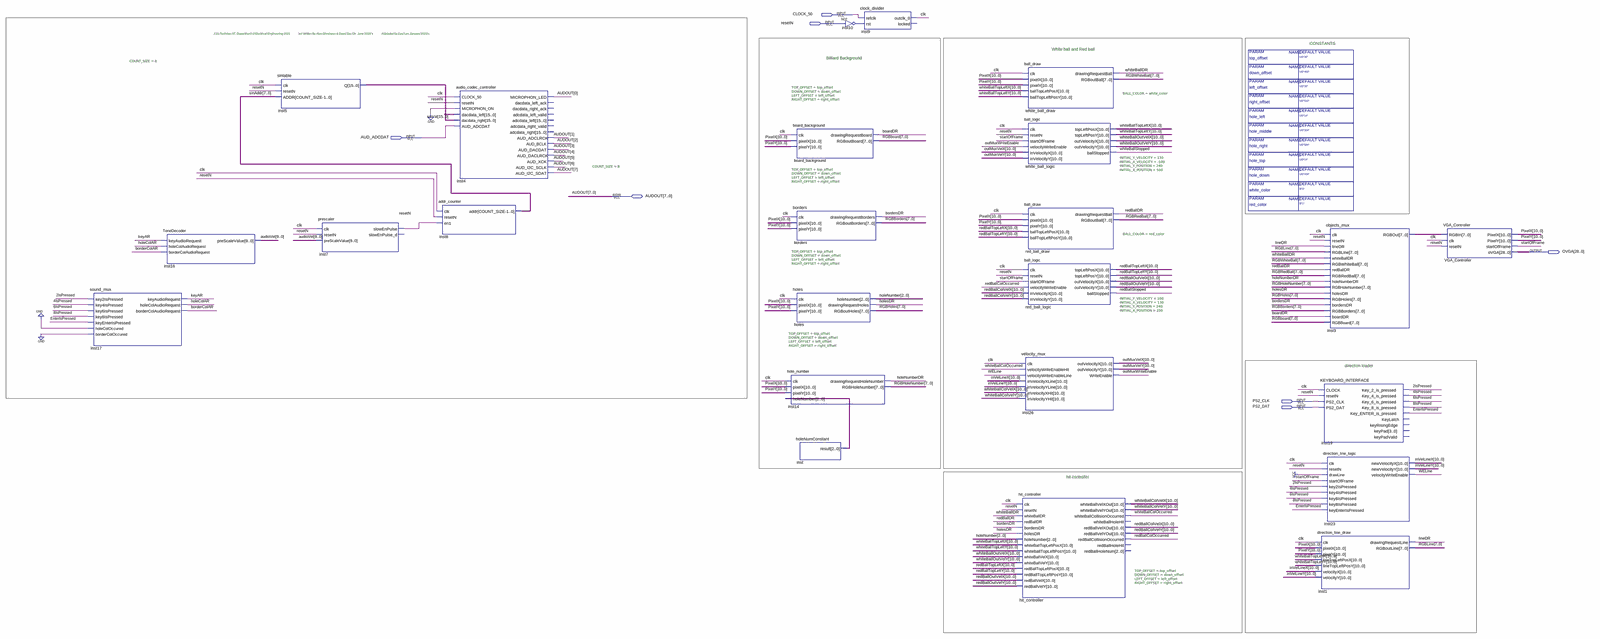
[diagram p0: schematic sheet, whole]
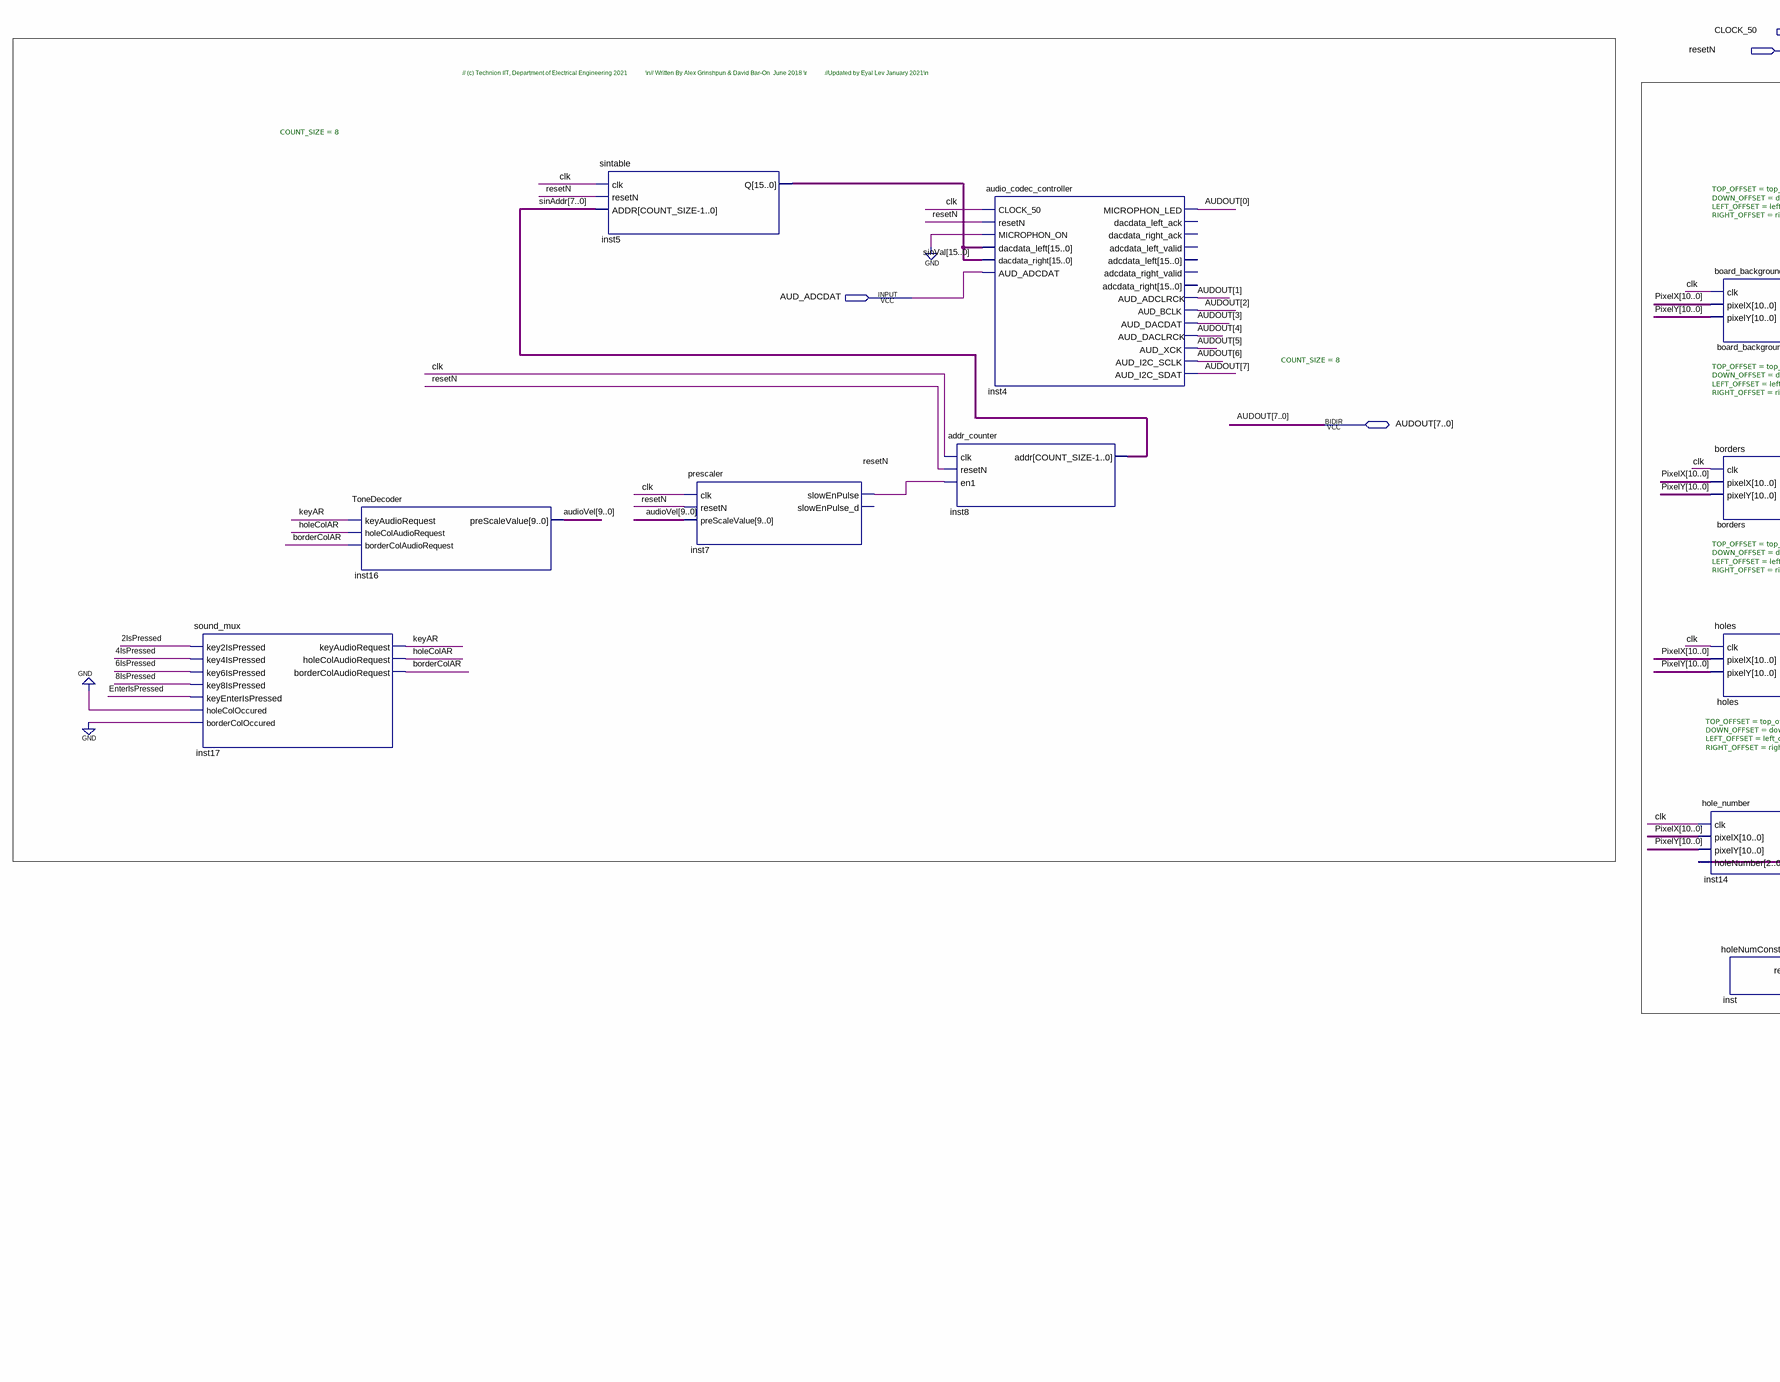
[diagram p1: schematic sheet, left part]
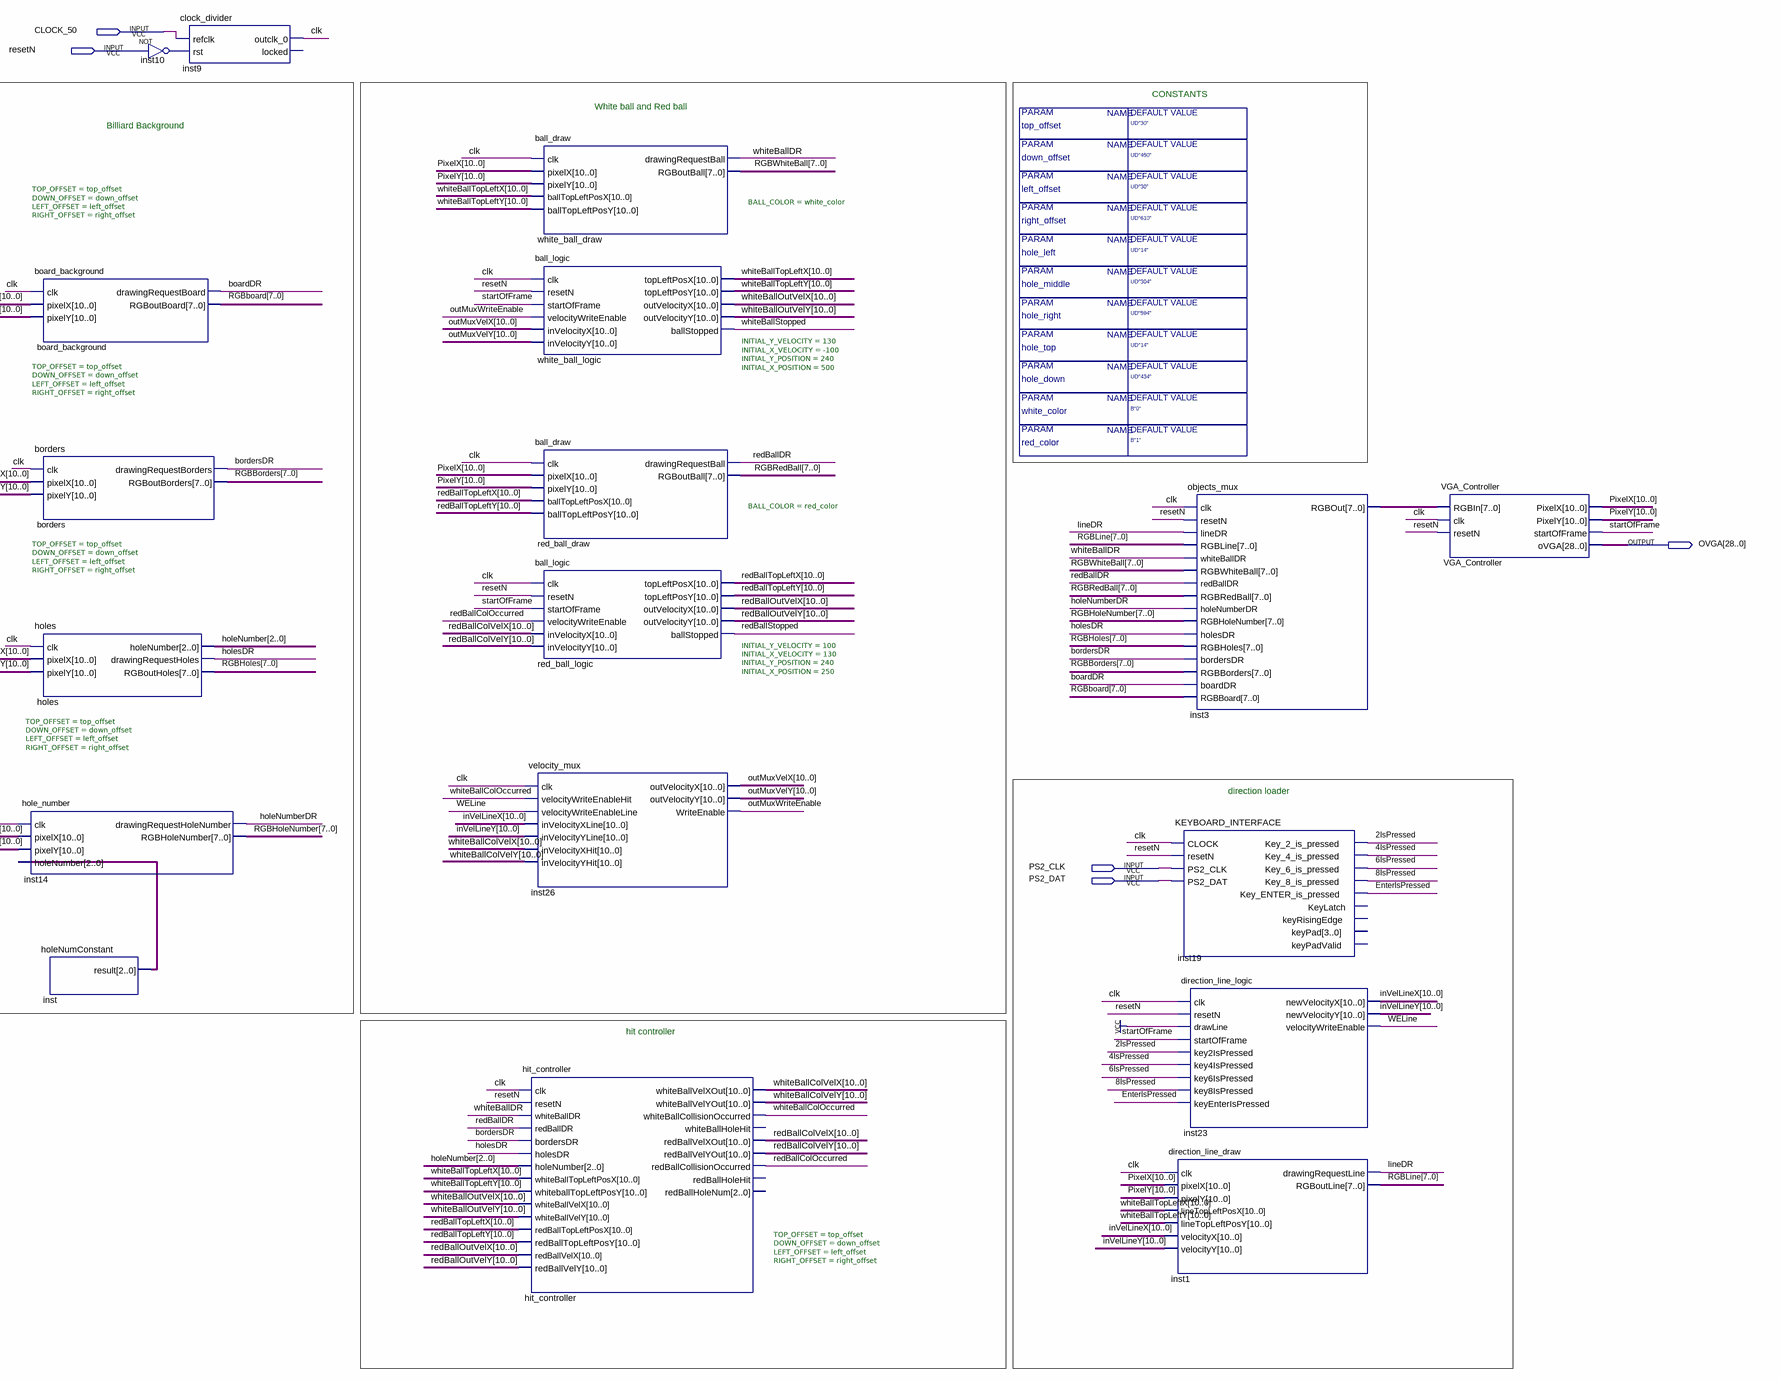
[diagram p2: schematic sheet, right part]
// Quartus schematic BILLIARD_GAME_ORIT.bdf as structural Verilog: 24 symbols, 7 pins
module BILLIARD_GAME_ORIT #(parameter hole_left = "UD\"14\"", parameter white_color = 'b0, parameter red_color = 'b1, parameter down_offset = "UD\"450\"", parameter right_offset = "UD\"610\"", parameter top_offset = "UD\"30\"", parameter left_offset = "UD\"30\"", parameter hole_right = "UD\"594\"", parameter hole_middle = "UD\"304\"", parameter hole_top = "UD\"14\"", parameter hole_down = "UD\"434\"") (
  input  CLOCK_50,
  input  resetN,
  input  AUD_ADCDAT,
  input  PS2_CLK,
  input  PS2_DAT,
  inout  [7:0] AUDOUT,
  output [28:0] OVGA
);

  wire \2IsPressed , \4IsPressed , \6IsPressed , \8IsPressed , boardDR, borderColAR, bordersDR, clk,
       EnterIsPressed, holeColAR, holeNumberDR, holesDR, inst7_slowenpulse, inst10_out, keyAR, lineDR,
       outMuxWriteEnable, redBallColOccurred, redBallDR, redBallStopped, startOfFrame, WELine,
       whiteBallColOccurred, whiteBallDR, whiteBallStopped;
  wire [2:0] holeNumber, inst_result;
  wire [7:0] inst3_rgbout, RGBboard, RGBBorders, RGBHoleNumber, RGBHoles, RGBLine, RGBRedBall, RGBWhiteBall,
       sinAddr;
  wire [9:0] audioVel;
  wire [10:0] inVelLineX, inVelLineY, outMuxVelX, outMuxVelY, PixelX, PixelY, redBallColVelX, redBallColVelY,
       redBallOutVelX, redBallOutVelY, redBallTopLeftX, redBallTopLeftY, whiteBallColVelX, whiteBallColVelY,
       whiteBallOutVelX, whiteBallOutVelY, whiteBallTopLeftX, whiteBallTopLeftY;
  wire [15:0] sinVal;

  sound_mux inst17 (
    .key2IsPressed(\2IsPressed ), .key4IsPressed(\4IsPressed ), .key6IsPressed(\6IsPressed ),
    .key8IsPressed(\8IsPressed ), .keyEnterIsPressed(EnterIsPressed), .holeColOccured(1'b0),
    .borderColOccured(1'b0), .keyAudioRequest(keyAR), .holeColAudioRequest(holeColAR),
    .borderColAudioRequest(borderColAR));
  ToneDecoder inst16 (
    .keyAudioRequest(keyAR), .holeColAudioRequest(holeColAR), .borderColAudioRequest(borderColAR),
    .preScaleValue(audioVel));
  sintable #(.COUNT_SIZE(8)) inst5 (.clk(clk), .resetN(resetN), .ADDR(sinAddr), .Q(sinVal));
  prescaler inst7 (
    .clk(clk), .resetN(resetN), .preScaleValue(audioVel), .slowEnPulse(inst7_slowenpulse));  // open: slowEnPulse_d
  addr_counter #(.COUNT_SIZE(8)) inst8 (.clk(clk), .resetN(resetN), .en1(inst7_slowenpulse), .addr(sinAddr));
  audio_codec_controller inst4 (
    .CLOCK_50(clk), .resetN(resetN), .MICROPHON_ON(1'b0), .dacdata_left(sinVal), .dacdata_right(sinVal),
    .AUD_ADCDAT(AUD_ADCDAT), .MICROPHON_LED(AUDOUT[0]), .AUD_DACDAT(AUDOUT[3]), .AUD_XCK(AUDOUT[5]),
    .AUD_I2C_SCLK(AUDOUT[6]), .AUD_ADCLRCK(AUDOUT[1]), .AUD_BCLK(AUDOUT[2]), .AUD_DACLRCK(AUDOUT[4]),
    .AUD_I2C_SDAT(AUDOUT[7]));  // open: dacdata_left_ack, dacdata_right_ack, adcdata_left_valid, adcdata_left, adcdata_right_valid, adcdata_right
  hole_number #(.TOP_OFFSET(top_offset), .DOWN_OFFSET(down_offset), .LEFT_OFFSET(left_offset), .RIGHT_OFFSET(right_offset)) inst14 (
    .clk(clk), .pixelX(PixelX), .pixelY(PixelY), .holeNumber(inst_result),
    .drawingRequestHoleNumber(holeNumberDR), .RGBHoleNumber(RGBHoleNumber));
  board_background #(.TOP_OFFSET(top_offset), .DOWN_OFFSET(down_offset), .LEFT_OFFSET(left_offset), .RIGHT_OFFSET(right_offset)) board_background (
    .clk(clk), .pixelX(PixelX), .pixelY(PixelY), .drawingRequestBoard(boardDR), .RGBoutBoard(RGBboard));
  borders #(.TOP_OFFSET(top_offset), .DOWN_OFFSET(down_offset), .LEFT_OFFSET(left_offset), .RIGHT_OFFSET(right_offset)) borders (
    .clk(clk), .pixelX(PixelX), .pixelY(PixelY), .drawingRequestBorders(bordersDR), .RGBoutBorders(RGBBorders));
  holes #(.TOP_OFFSET(top_offset), .DOWN_OFFSET(down_offset), .LEFT_OFFSET(left_offset), .RIGHT_OFFSET(right_offset)) holes (
    .clk(clk), .pixelX(PixelX), .pixelY(PixelY), .holeNumber(holeNumber), .drawingRequestHoles(holesDR),
    .RGBoutHoles(RGBHoles));
  holeNumConstant inst (.result(inst_result));
  clock_divider inst9 (.refclk(CLOCK_50), .rst(inst10_out), .outclk_0(clk));  // open: locked
  not inst10 (inst10_out, resetN);
  ball_draw #(.BALL_COLOR(white_color)) white_ball_draw (
    .clk(clk), .pixelX(PixelX), .pixelY(PixelY), .ballTopLeftPosX(whiteBallTopLeftX),
    .ballTopLeftPosY(whiteBallTopLeftY), .drawingRequestBall(whiteBallDR), .RGBoutBall(RGBWhiteBall));
  ball_logic #(.INITIAL_Y_VELOCITY(130), .INITIAL_X_VELOCITY(-100), .INITIAL_Y_POSITION(240), .INITIAL_X_POSITION(500)) white_ball_logic (
    .clk(clk), .resetN(resetN), .startOfFrame(startOfFrame), .velocityWriteEnable(outMuxWriteEnable),
    .inVelocityX(outMuxVelX), .inVelocityY(outMuxVelY), .topLeftPosX(whiteBallTopLeftX),
    .topLeftPosY(whiteBallTopLeftY), .outVelocityX(whiteBallOutVelX), .outVelocityY(whiteBallOutVelY),
    .ballStopped(whiteBallStopped));
  ball_draw #(.BALL_COLOR(red_color)) red_ball_draw (
    .clk(clk), .pixelX(PixelX), .pixelY(PixelY), .ballTopLeftPosX(redBallTopLeftX),
    .ballTopLeftPosY(redBallTopLeftY), .drawingRequestBall(redBallDR), .RGBoutBall(RGBRedBall));
  ball_logic #(.INITIAL_Y_VELOCITY(100), .INITIAL_X_VELOCITY(130), .INITIAL_Y_POSITION(240), .INITIAL_X_POSITION(250)) red_ball_logic (
    .clk(clk), .resetN(resetN), .startOfFrame(startOfFrame), .velocityWriteEnable(redBallColOccurred),
    .inVelocityX(redBallColVelX), .inVelocityY(redBallColVelY), .topLeftPosX(redBallTopLeftX),
    .topLeftPosY(redBallTopLeftY), .outVelocityX(redBallOutVelX), .outVelocityY(redBallOutVelY),
    .ballStopped(redBallStopped));
  velocity_mux inst26 (
    .clk(clk), .velocityWriteEnableHit(whiteBallColOccurred), .velocityWriteEnableLine(WELine),
    .inVelocityXLine(inVelLineX), .inVelocityYLine(inVelLineY), .inVelocityXHit(whiteBallColVelX),
    .inVelocityYHit(whiteBallColVelY), .outVelocityX(outMuxVelX), .outVelocityY(outMuxVelY),
    .WriteEnable(outMuxWriteEnable));
  hit_controller #(.TOP_OFFSET(top_offset), .DOWN_OFFSET(down_offset), .LEFT_OFFSET(left_offset), .RIGHT_OFFSET(right_offset)) hit_controller (
    .clk(clk), .resetN(resetN), .whiteBallDR(whiteBallDR), .redBallDR(redBallDR), .bordersDR(bordersDR),
    .holesDR(holesDR), .holeNumber(holeNumber), .whiteBallTopLeftPosX(whiteBallTopLeftX),
    .whiteballTopLeftPosY(whiteBallTopLeftY), .whiteBallVelX(whiteBallOutVelX),
    .whiteBallVelY(whiteBallOutVelY), .redBallTopLeftPosX(redBallTopLeftX),
    .redBallTopLeftPosY(redBallTopLeftY), .redBallVelX(redBallOutVelX), .redBallVelY(redBallOutVelY),
    .whiteBallVelXOut(whiteBallColVelX), .whiteBallVelYOut(whiteBallColVelY),
    .whiteBallCollisionOccurred(whiteBallColOccurred), .redBallVelXOut(redBallColVelX),
    .redBallVelYOut(redBallColVelY), .redBallCollisionOccurred(redBallColOccurred));  // open: whiteBallHoleHit, redBallHoleHit, redBallHoleNum
  objects_mux inst3 (
    .clk(clk), .resetN(resetN), .lineDR(lineDR), .RGBLine(RGBLine), .whiteBallDR(whiteBallDR),
    .RGBWhiteBall(RGBWhiteBall), .redBallDR(redBallDR), .RGBRedBall(RGBRedBall), .holeNumberDR(holeNumberDR),
    .RGBHoleNumber(RGBHoleNumber), .holesDR(holesDR), .RGBHoles(RGBHoles), .bordersDR(bordersDR),
    .RGBBorders(RGBBorders), .boardDR(boardDR), .RGBBoard(RGBboard), .RGBOut(inst3_rgbout));
  KEYBOARD_INTERFACE inst19 (
    .CLOCK(clk), .resetN(resetN), .PS2_CLK(PS2_CLK), .PS2_DAT(PS2_DAT), .Key_2_is_pressed(\2IsPressed ),
    .Key_4_is_pressed(\4IsPressed ), .Key_6_is_pressed(\6IsPressed ), .Key_8_is_pressed(\8IsPressed ),
    .Key_ENTER_is_pressed(EnterIsPressed));  // open: KeyLatch, keyRisingEdge, keyPad, keyPadValid
  direction_line_logic inst23 (
    .clk(clk), .resetN(resetN), .drawLine(1'b1), .startOfFrame(startOfFrame), .key2IsPressed(\2IsPressed ),
    .key4IsPressed(\4IsPressed ), .key6IsPressed(\6IsPressed ), .key8IsPressed(\8IsPressed ),
    .keyEnterIsPressed(EnterIsPressed), .newVelocityX(inVelLineX), .newVelocityY(inVelLineY),
    .velocityWriteEnable(WELine));
  direction_line_draw inst1 (
    .clk(clk), .pixelX(PixelX), .pixelY(PixelY), .lineTopLeftPosX(whiteBallTopLeftX),
    .lineTopLeftPosY(whiteBallTopLeftY), .velocityX(inVelLineX), .velocityY(inVelLineY),
    .drawingRequestLine(lineDR), .RGBoutLine(RGBLine));
  VGA_Controller VGA_Controller (
    .RGBIn(inst3_rgbout), .clk(clk), .resetN(resetN), .PixelX(PixelX), .PixelY(PixelY),
    .startOfFrame(startOfFrame), .oVGA(OVGA));

  // Notes on the sheet:
  //   // (c) Technion IIT, Department of Electrical Engineering 2021            \n// Written By Alex Grinshpun & David Bar-On  June 2018 \r            //Updated by Eyal Lev January 2021\n
  //   CONSTANTS
  //   White ball and Red ball
  //   Billiard Background
  //   direction loader
  //   hit controller
endmodule
